# Altium schematic sheet Sensors.SchDoc
size A4; SheetNumber: 2; SheetTotal: 5
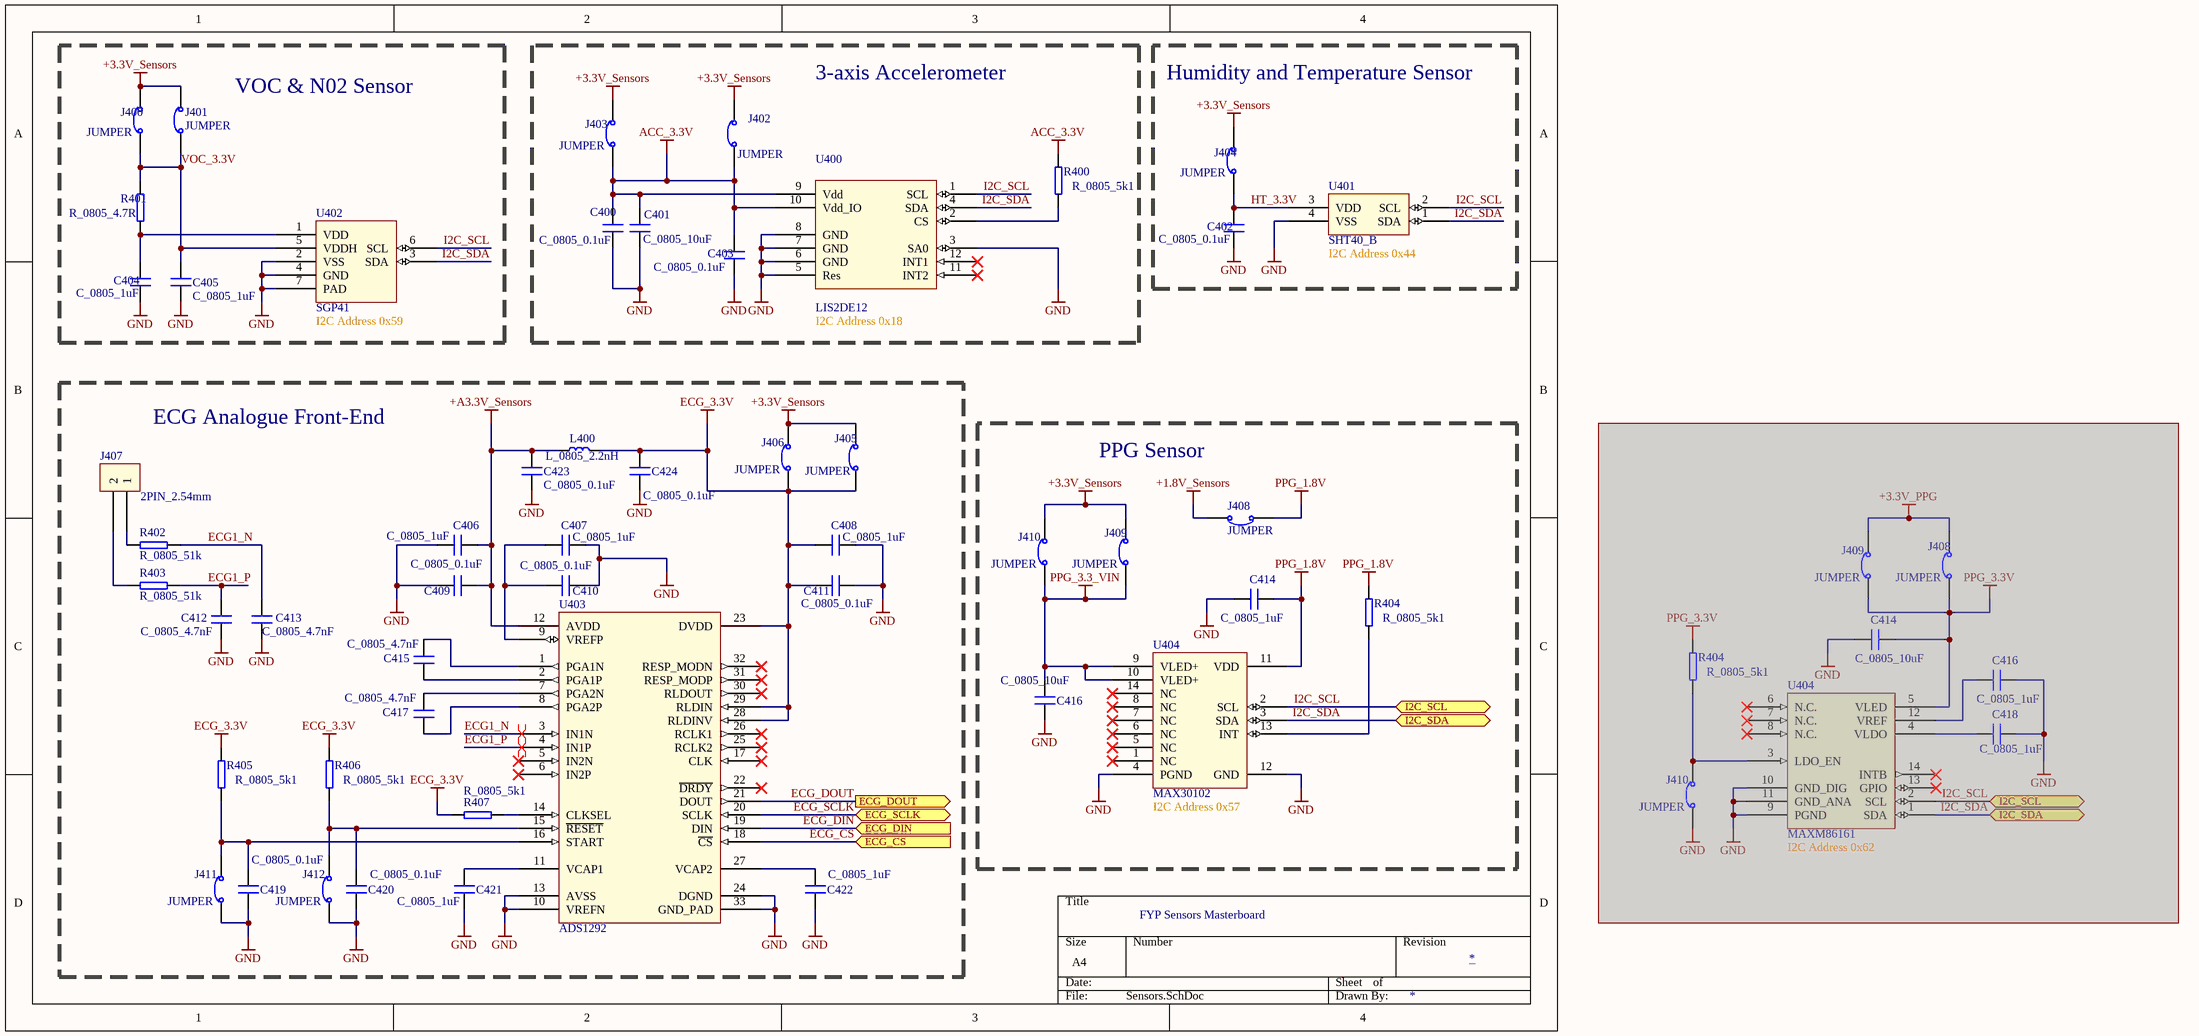
[diagram p0: Sensors.SchDoc]

## Parts
(Parts that share a designator on the sheet are numbered #1, #2 ... from top to bottom, then left to right.)
C400  C_0805_0.1uF  [CAP_0805]
C401  C_0805_10uF  [CAP_0805]
C402  C_0805_0.1uF  [CAP_0805]
C403  C_0805_0.1uF  [CAP_0805]
C404  C_0805_1uF  [CAP_0805]
C405  C_0805_1uF  [CAP_0805]
C406  C_0805_1uF  [CAP_0805]
C407  C_0805_1uF  [CAP_0805]
C408  C_0805_1uF  [CAP_0805]
C409  C_0805_0.1uF  [CAP_0805]
C410  C_0805_0.1uF  [CAP_0805]
C411  C_0805_0.1uF  [CAP_0805]
C412  C_0805_4.7nF  [CAP_0805]
C413  C_0805_4.7nF  [CAP_0805]
C414#1  C_0805_1uF  [CAP_0805]
C414#2  C_0805_10uF  [CAP_0805]  (masked out: inside a compile mask, not in the netlist)
C415  C_0805_4.7nF  [CAP_0805]
C416#1  C_0805_1uF  [CAP_0805]  (masked out: inside a compile mask, not in the netlist)
C416#2  C_0805_10uF  [CAP_0805]
C417  C_0805_4.7nF  [CAP_0805]
C418  C_0805_1uF  [CAP_0805]  (masked out: inside a compile mask, not in the netlist)
C419  C_0805_0.1uF  [CAP_0805]
C420  C_0805_0.1uF  [CAP_0805]
C421  C_0805_1uF  [CAP_0805]
C422  C_0805_1uF  [CAP_0805]
C423  C_0805_0.1uF  [CAP_0805]
C424  C_0805_0.1uF  [CAP_0805]
J400  JUMPER  [2PIN_2.54mm-Footprint-1]
J401  JUMPER  [2PIN_2.54mm-Footprint-1]
J402  JUMPER  [2PIN_2.54mm-Footprint-1]
J403  JUMPER  [2PIN_2.54mm-Footprint-1]
J404  JUMPER  [2PIN_2.54mm-Footprint-1]
J405  JUMPER  [2PIN_2.54mm-Footprint-1]
J406  JUMPER  [2PIN_2.54mm-Footprint-1]
J407  2PIN_2.54mm  [2PIN_2.54mm-Footprint-1]
J408#1  JUMPER  [2PIN_2.54mm-Footprint-1]
J408#2  JUMPER  [2PIN_2.54mm-Footprint-1]  (masked out: inside a compile mask, not in the netlist)
J409#1  JUMPER  [2PIN_2.54mm-Footprint-1]
J409#2  JUMPER  [2PIN_2.54mm-Footprint-1]  (masked out: inside a compile mask, not in the netlist)
J410#1  JUMPER  [2PIN_2.54mm-Footprint-1]
J410#2  JUMPER  [2PIN_2.54mm-Footprint-1]  (masked out: inside a compile mask, not in the netlist)
J411  JUMPER  [2PIN_2.54mm-Footprint-1]
J412  JUMPER  [2PIN_2.54mm-Footprint-1]
L400  L_0805_2.2nH  [L_0805]
R400  R_0805_5k1  [0805_RES]
R401  R_0805_4.7R  [0805_RES]
R402  R_0805_51k  [0805_RES]
R403  R_0805_51k  [0805_RES]
R404#1  R_0805_5k1  [0805_RES]
R404#2  R_0805_5k1  [0805_RES]  (masked out: inside a compile mask, not in the netlist)
R405  R_0805_5k1  [0805_RES]
R406  R_0805_5k1  [0805_RES]
R407  R_0805_5k1  [0805_RES]
U400  LIS2DE12  [LIS2DE12-Footprint-1]
U401  SHT40_B  [SHT40_B-Footprint-1]
U402  SGP41  [SGP41-D-R4-Footprint-2]
U403  ADS1292  [QFN127P600-8N]
U404#1  MAX30102  [MAX30102-Footprint-1]
U404#2  MAXM86161  (masked out: inside a compile mask, not in the netlist)

## Blocks framed on the sheet
VOC & N02 Sensor: C404 C405 J400 J401 R401 U402
3-axis Accelerometer: C400 C401 C403 J402 J403 R400 U400
Humidity and Temperature Sensor: C402 J404 U401
ECG Analogue Front-End: C406-C413 C415 C417 C419-C424 J405-J407 J411 J412 L400 R402 R403 R405-R407 U403
PPG Sensor: C414#1 C416#2 J408#1 J409#1 J410#1 R404#1 U404#1

## Ports
ECG_CS (in, see Sensors_Power_Characterisation_Board[2B], MCU_main[4B]), ECG_DIN (in, see Sensors_Power_Characterisation_Board[2B], MCU_main[4B]), ECG_DOUT (out, see Sensors_Power_Characterisation_Board[2B], MCU_main[2B]), ECG_SCLK (bidir, see Sensors_Power_Characterisation_Board[2B], MCU_main[2B]), I2C_SCL (bidir, see Sensors_Power_Characterisation_Board[2B]), I2C_SDA (bidir, see Sensors_Power_Characterisation_Board[2B])

## Nets
+1.8V_Sensors: J408#1.2
+3.3V_Sensors: J400.2 J401.2 J402.2 J403.2 J404.2 J405.2 J406.2 J409#1.2 J410#1.2
+A3.3V_Sensors: C406.2 C409.2 C423.2 L400.1 U403.12(AVDD)
ACC_3.3V: C400.2 C401.2 C403.2 J402.1 J403.1 R400.2 U400.9(Vdd) U400.10(Vdd_IO)
ECG_3.3V: C408.1 C411.1 C424.2 J405.1 J406.1 L400.2 R405.2 R406.2 R407.2 U403.23(DVDD) U403.28(RLDINV) U403.29(RLDIN)
GND: C400.1 C401.1 C402.1 C403.1 C404.1 C405.1 C406.1 C407.1 C408.2 C409.1 C410.1 C411.2 C412.1 C413.1 C414#1.1 C416#2.1 C419.1 C420.1 C421.1 C422.1 C423.1 C424.1 J411.1 J412.1 U400.3(SA0) U400.5(Res) U400.6(GND) U400.7(GND) U400.8(GND) U401.4(VSS) U402.2(VSS) U402.4(GND) U402.7(PAD) U403.10(VREFN) U403.13(AVSS) U403.24(DGND) U403.33(GND_PAD) U404#1.4(PGND) U404#1.12(GND)
PPG_1.8V: C414#1.2 J408#1.1 R404#1.2 U404#1.11(VDD)
PPG_3.3_VIN: C416#2.2 J409#1.1 J410#1.1 U404#1.9(VLED+) U404#1.10(VLED+)
ECG1_N: C413.2 R402.1 U403.3(IN1N)
ECG1_P: C412.2 R403.1 U403.4(IN1P)
ECG_CS: U403.18(~{CS}) ; port ECG_CS
ECG_DIN: U403.19(DIN) ; port ECG_DIN
ECG_DOUT: U403.21(DOUT) ; port ECG_DOUT
ECG_SCLK: U403.20(SCLK) ; port ECG_SCLK
HT_3.3V: C402.2 J404.1 U401.3(VDD)
I2C_SCL: U400.1(SCL) U401.2(SCL) U402.6(SCL) U404#1.2(SCL) ; port I2C_SCL
I2C_SDA: U400.4(SDA) U401.1(SDA) U402.3(SDA) U404#1.3(SDA) ; port I2C_SDA
VOC_3.3V: C405.2 J400.1 J401.1 R401.1 U402.5(VDDH)
NetC404_2: C404.2 R401.2 U402.1(VDD)
NetC407_2: C407.2 C410.2 U403.9(VREFP)
NetC415_1: C415.1 U403.2(PGA1P)
NetC415_2: C415.2 U403.1(PGA1N)
NetC417_1: C417.1 U403.8(PGA2P)
NetC417_2: C417.2 U403.7(PGA2N)
NetC419_2: C419.2 J411.2 R405.1 U403.16(START)
NetC420_2: C420.2 J412.2 R406.1 U403.15(~{RESET})
NetC421_2: C421.2 U403.11(VCAP1)
NetC422_2: C422.2 U403.27(VCAP2)
NetJ407_1: J407.1 R402.2
NetJ407_2: J407.2 R403.2
NetR400_1: R400.1 U400.2(CS)
NetR404#1_1: R404#1.1 U404#1.13(INT)
NetR407_1: R407.1 U403.14(CLKSEL)

Not connected (* = marked no-connect by the designer): U400 11(INT2)* 12(INT1)*; U403 5(IN2N)* 6(IN2P)* 17(CLK)* 22(~{DRDY})* 25(RCLK2)* 26(RCLK1)* 30(RLDOUT)* 31(RESP_MODP)* 32(RESP_MODN)*; U404#1 1(NC)* 5(NC)* 6(NC)* 7(NC)* 8(NC)* 14(NC)*

## Layout directives
differential pair: ECG1_N, ECG1_P

## Notes on the sheet
- (near U401) I2C Address 0x44
- (near U402) I2C Address 0x59
- (near U400) I2C Address 0x18
- (near U404#1) I2C Address 0x57
- (near U404#2) I2C Address 0x62
- FYP Sensors Masterboard

## Library data of the parts
C400 C402 C403 C409-C411 C419 C420 C423 C424 = CMP-00002-3: JLC Part Number: C28233
C401 C414#2 C416#2 = CMP-00006-2: JLC Part Number: C15850
C404-C408 C414#1 C416#1 C418 C421 C422 = CMP-00004-3: JLC Part Number: C28323
C412 C413 C415 C417 = CMP-00027-3: JLC Part Number: C1744
J400-J406 J408#1 J408#2 J409#1 J409#2 J410#1 J410#2 J411 J412 = CMP-00028-2: 2 pin jumper; JLC Part Number: C5360898
J407 = CMP-00018-3: 2 pin power input; JLC Part Number: C5360898
L400 = CMP-00011-3: Required a minimum current of 500mA and a resonant frequrency of at least 6GHz; JLC Part Number: C964055
R400 R404#1 R404#2 R405-R407 = CMP-00014-2: JLC Part Number: C27834
R401 = CMP-00007-3: JLC Part Number: C17675
R402 R403 = CMP-00039-2: JLC Part Number: C17737
U400 = CMP-00005-10: Accelerometers MEMS digital output motion sensor: ultra-low-power high-performance 3-axis "femt; Order Code: 511-LIS2DE12TR; JLC Part Number: C155639; Distributor: Mouser
U401 = CMP-00001-4: Board Mount Humidity Sensors +/-1.8%RH/+/-0.2C, 4th generation, digital (I2C) humidity and temperature sensor with 0x45 I2C address.; JLC Part Number: C3664342
U402 = CMP-00000-7: Air Quality Sensors VOC and NOx (MOX) Gas Pollutant Sensor; Order Code: 403-SGP41-D-R4; JLC Part Number: C3659325; Distributor: Mouser
U403 = CMP-00026-5: ECG Analog Front End - AFE 2-Channel,24B ADC; Order Code: 595-ADS1292RIRSMT; Distributor: Mouser; JLC Part Number: C456281
U404#1 = CMP-00048-2: Biometric Sensors Integrated Optical Sensor; Order Code: 700-MAX30102EFD+T; JLC Part Number: C6454833; Distributor: Mouser
U404#2 = CMP-00041-1: PPG Biometric Sensors Optical Bio Sensor Module Optimized for Wearables; Order Code: 700-MAXM86161EFD+T; Distributor: Mouser